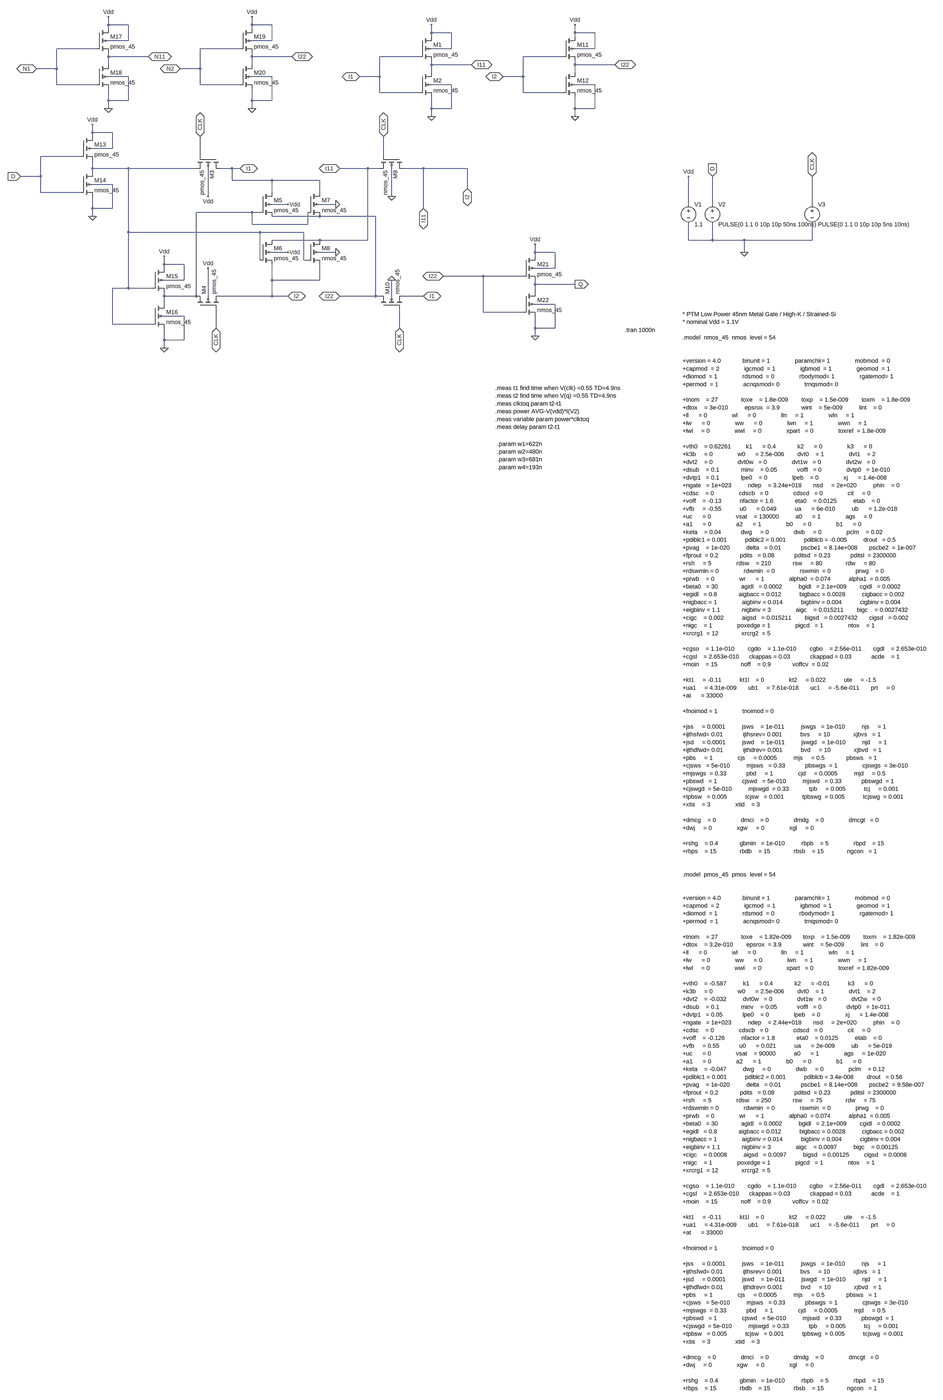
[diagram p0: schematic ACFF.asc, whole sheet]
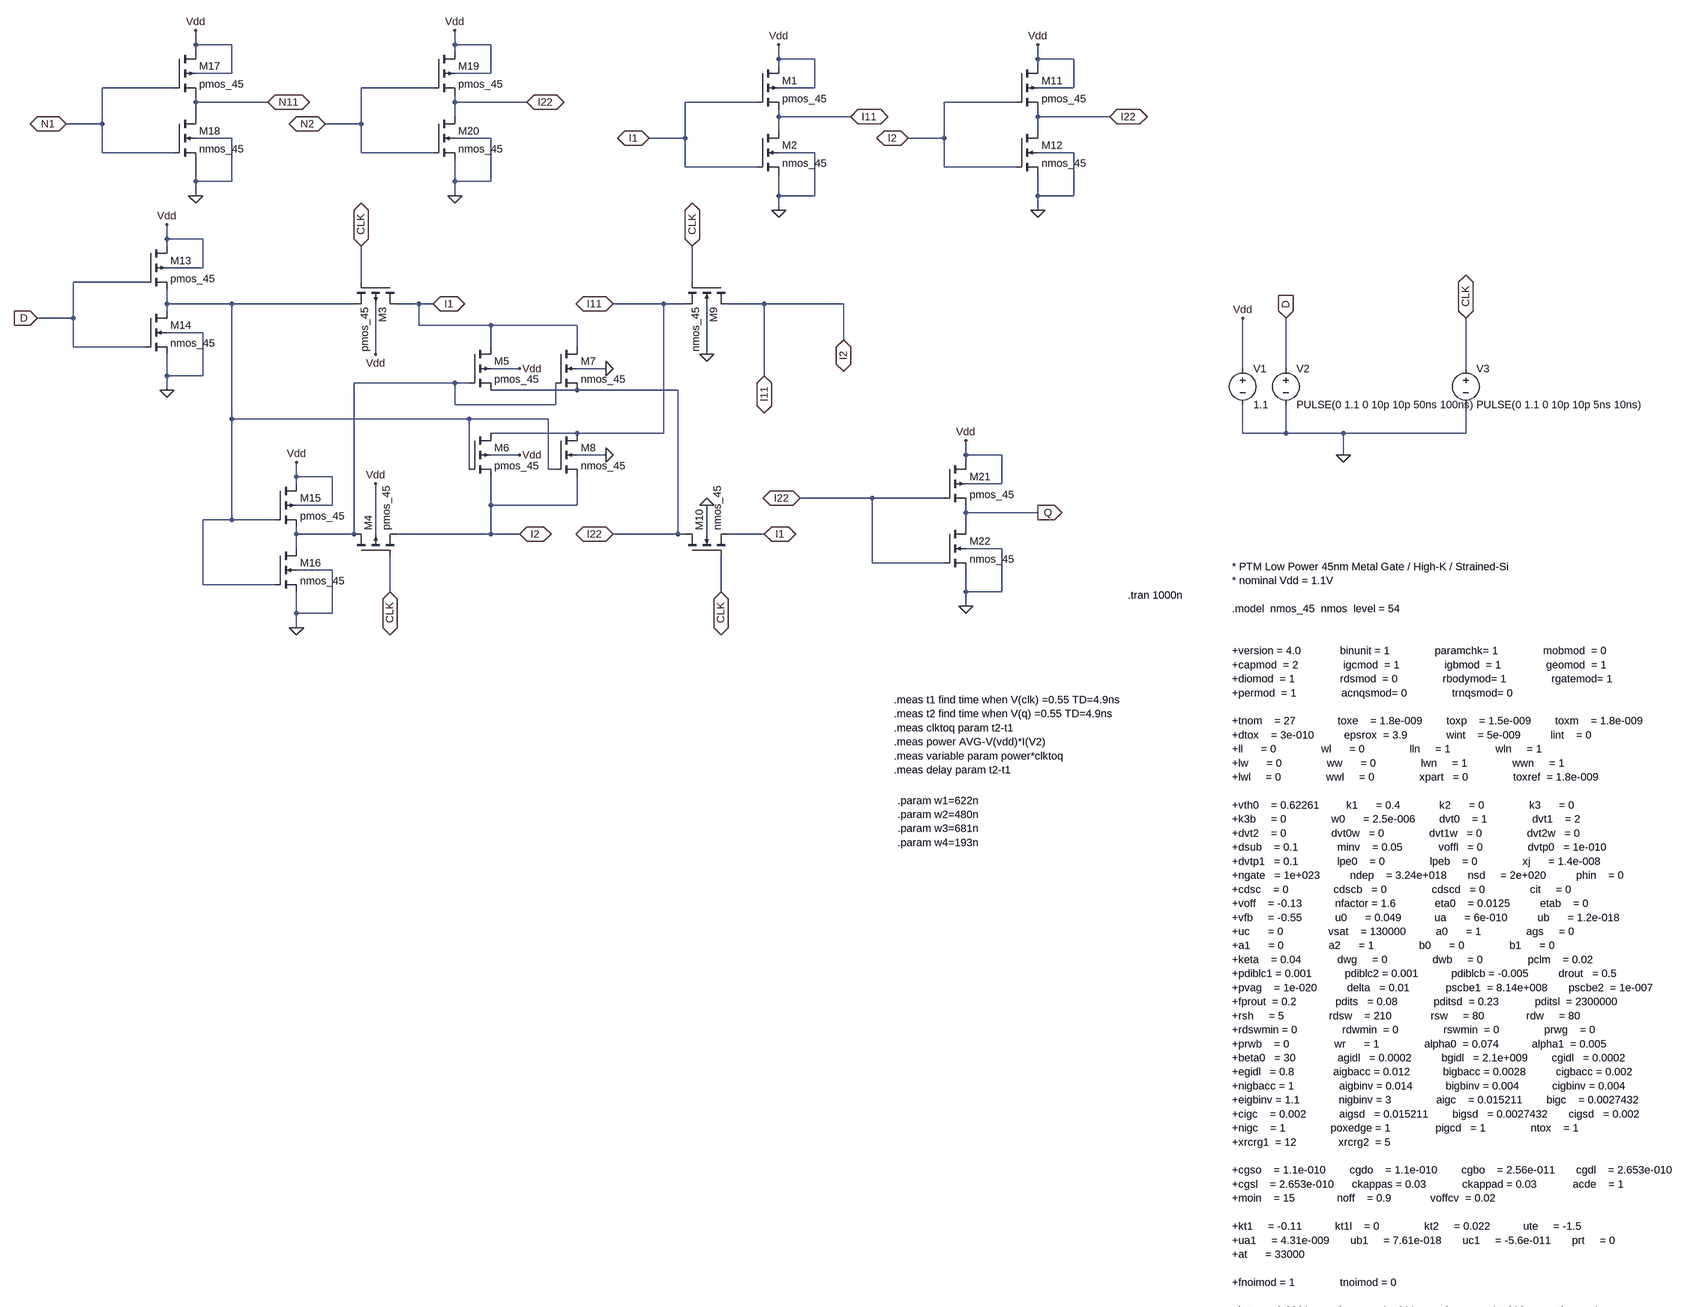
[diagram p1: schematic ACFF.asc, part, row 1 of 2, column 1 of 1]
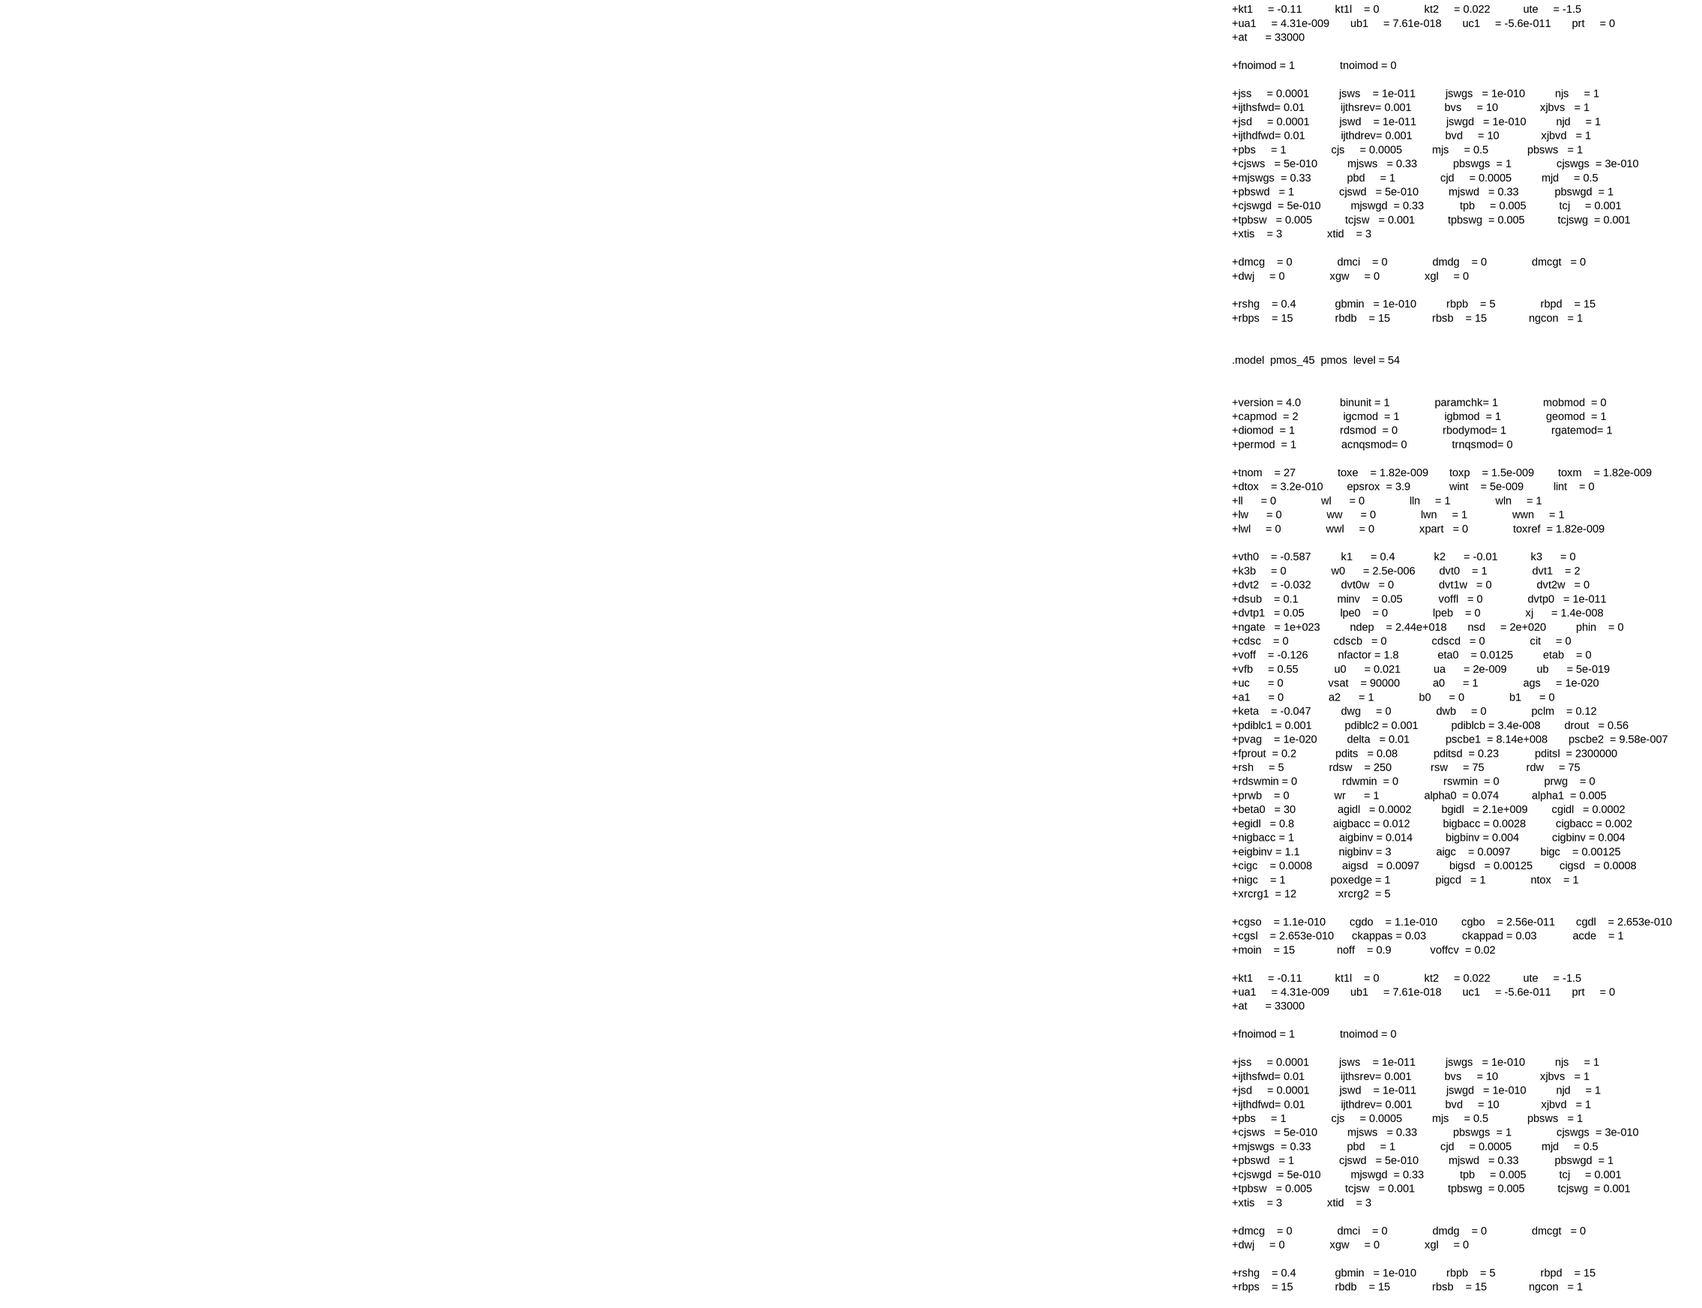
[diagram p2: schematic ACFF.asc, part, row 2 of 2, column 1 of 1]
ACFF.asc, the LTspice schematic file:
Version 4
SHEET 1 3184 4884
WIRE -432 -176 -432 -208
WIRE -352 -176 -432 -176
WIRE 144 -176 144 -208
WIRE 224 -176 144 -176
WIRE -432 -160 -432 -176
WIRE 144 -160 144 -176
WIRE 864 -144 864 -176
WIRE 944 -144 864 -144
WIRE 1440 -144 1440 -176
WIRE 1520 -144 1440 -144
WIRE 864 -128 864 -144
WIRE 1440 -128 1440 -144
WIRE -352 -112 -352 -176
WIRE -352 -112 -432 -112
WIRE 224 -112 224 -176
WIRE 224 -112 144 -112
WIRE -480 -80 -640 -80
WIRE 96 -80 -64 -80
WIRE 944 -80 944 -144
WIRE 944 -80 864 -80
WIRE 1520 -80 1520 -144
WIRE 1520 -80 1440 -80
WIRE -432 -48 -432 -64
WIRE -272 -48 -432 -48
WIRE 144 -48 144 -64
WIRE 304 -48 144 -48
WIRE 816 -48 656 -48
WIRE 1392 -48 1232 -48
WIRE -432 -16 -432 -48
WIRE 144 -16 144 -48
WIRE 864 -16 864 -32
WIRE 1024 -16 864 -16
WIRE 1440 -16 1440 -32
WIRE 1600 -16 1440 -16
WIRE -640 0 -640 -80
WIRE -640 0 -720 0
WIRE -64 0 -64 -80
WIRE -64 0 -144 0
WIRE 864 16 864 -16
WIRE 1440 16 1440 -16
WIRE -352 32 -432 32
WIRE 224 32 144 32
WIRE 656 32 656 -48
WIRE 656 32 576 32
WIRE 1232 32 1232 -48
WIRE 1232 32 1152 32
WIRE -640 64 -640 0
WIRE -480 64 -640 64
WIRE -64 64 -64 0
WIRE 96 64 -64 64
WIRE 944 64 864 64
WIRE 1520 64 1440 64
WIRE 656 96 656 32
WIRE 816 96 656 96
WIRE 1232 96 1232 32
WIRE 1392 96 1232 96
WIRE -432 128 -432 80
WIRE -352 128 -352 32
WIRE -352 128 -432 128
WIRE 144 128 144 80
WIRE 224 128 224 32
WIRE 224 128 144 128
WIRE -432 160 -432 128
WIRE 144 160 144 128
WIRE 864 160 864 112
WIRE 944 160 944 64
WIRE 944 160 864 160
WIRE 1440 160 1440 112
WIRE 1520 160 1520 64
WIRE 1520 160 1440 160
WIRE 864 192 864 160
WIRE 1440 192 1440 160
WIRE -496 256 -496 224
WIRE -416 256 -496 256
WIRE -496 272 -496 256
WIRE -416 320 -416 256
WIRE -416 320 -496 320
WIRE -544 352 -704 352
WIRE -64 352 -64 272
WIRE 672 352 672 272
WIRE -496 400 -496 368
WIRE -352 400 -496 400
WIRE -80 400 -352 400
WIRE 64 400 16 400
WIRE 96 400 64 400
WIRE 608 400 496 400
WIRE 656 400 608 400
WIRE 832 400 752 400
WIRE 1008 400 832 400
WIRE -496 416 -496 400
WIRE -704 432 -704 352
WIRE -704 432 -784 432
WIRE 64 448 64 400
WIRE 224 448 64 448
WIRE 416 448 224 448
WIRE -416 464 -496 464
WIRE 1008 480 1008 400
WIRE -704 496 -704 432
WIRE -544 496 -704 496
WIRE 224 496 224 448
WIRE 416 496 416 448
WIRE -32 512 -32 400
WIRE 704 512 704 400
WIRE 288 544 224 544
WIRE 480 544 416 544
WIRE 2112 544 2112 432
WIRE 2208 544 2208 432
WIRE 2608 544 2608 432
WIRE -496 560 -496 512
WIRE -416 560 -416 464
WIRE -416 560 -496 560
WIRE 832 560 832 400
WIRE 144 576 -80 576
WIRE 176 576 144 576
WIRE -496 592 -496 560
WIRE 416 592 224 592
WIRE 640 592 416 592
WIRE 144 624 144 576
WIRE 368 624 368 576
WIRE 368 624 144 624
WIRE -352 656 -352 400
WIRE 176 656 -352 656
WIRE 352 656 176 656
WIRE 416 688 224 688
WIRE 608 688 608 400
WIRE 608 688 416 688
WIRE 2112 688 2112 624
WIRE 2208 688 2208 624
WIRE 2208 688 2112 688
WIRE 2336 688 2208 688
WIRE 2608 688 2608 624
WIRE 2608 688 2336 688
WIRE 288 736 224 736
WIRE 480 736 416 736
WIRE 1280 736 1280 704
WIRE 1360 736 1280 736
WIRE 2336 736 2336 688
WIRE 1280 752 1280 736
WIRE 176 768 176 656
WIRE 352 768 352 656
WIRE 368 768 352 768
WIRE -208 784 -208 752
WIRE -128 784 -208 784
WIRE -208 800 -208 784
WIRE 1360 800 1360 736
WIRE 1360 800 1280 800
WIRE 1072 832 912 832
WIRE 1232 832 1072 832
WIRE -128 848 -128 784
WIRE -128 848 -208 848
WIRE 224 848 224 784
WIRE 416 848 416 784
WIRE 416 848 224 848
WIRE 1280 864 1280 848
WIRE 1440 864 1280 864
WIRE -352 880 -352 656
WIRE -352 880 -416 880
WIRE -256 880 -352 880
WIRE 1280 896 1280 864
WIRE -208 912 -208 896
WIRE -80 912 -80 576
WIRE -80 912 -208 912
WIRE -32 912 -32 800
WIRE 224 912 224 848
WIRE 224 912 16 912
WIRE 288 912 224 912
WIRE 640 912 640 592
WIRE 640 912 496 912
WIRE 656 912 640 912
WIRE 704 912 704 848
WIRE 832 912 752 912
WIRE -208 944 -208 912
WIRE 1360 944 1280 944
WIRE 1072 976 1072 832
WIRE 1232 976 1072 976
WIRE -128 992 -208 992
WIRE -416 1024 -416 880
WIRE -256 1024 -416 1024
WIRE 0 1040 0 960
WIRE 736 1040 736 960
WIRE 1280 1040 1280 992
WIRE 1360 1040 1360 944
WIRE 1360 1040 1280 1040
WIRE 1280 1072 1280 1040
WIRE -208 1088 -208 1040
WIRE -128 1088 -128 992
WIRE -128 1088 -208 1088
WIRE -208 1120 -208 1088
FLAG 864 -176 Vdd
FLAG 864 192 0
FLAG 576 32 I1
IOPIN 576 32 BiDir
FLAG 1024 -16 I11
IOPIN 1024 -16 BiDir
FLAG 1440 -176 Vdd
FLAG 1440 192 0
FLAG 1152 32 I2
IOPIN 1152 32 BiDir
FLAG 1600 -16 I22
IOPIN 1600 -16 BiDir
FLAG -496 224 Vdd
FLAG -496 592 0
FLAG -784 432 D
IOPIN -784 432 In
FLAG -208 752 Vdd
FLAG -208 1120 0
FLAG -64 272 CLK
IOPIN -64 272 BiDir
FLAG 672 272 CLK
IOPIN 672 272 BiDir
FLAG 0 1040 CLK
IOPIN 0 1040 BiDir
FLAG 736 1040 CLK
IOPIN 736 1040 BiDir
FLAG 96 400 I1
IOPIN 96 400 BiDir
FLAG 496 400 I11
IOPIN 496 400 BiDir
FLAG 288 912 I2
IOPIN 288 912 BiDir
FLAG 496 912 I22
IOPIN 496 912 BiDir
FLAG -432 -208 Vdd
FLAG -432 160 0
FLAG -720 0 N1
IOPIN -720 0 BiDir
FLAG -272 -48 N11
IOPIN -272 -48 BiDir
FLAG 144 -208 Vdd
FLAG 144 160 0
FLAG -144 0 N2
IOPIN -144 0 BiDir
FLAG 304 -48 I22
IOPIN 304 -48 BiDir
FLAG 1280 704 Vdd
FLAG 1280 1072 0
FLAG 832 912 I1
IOPIN 832 912 BiDir
FLAG 832 560 I11
IOPIN 832 560 BiDir
FLAG 1008 480 I2
IOPIN 1008 480 BiDir
FLAG 912 832 I22
IOPIN 912 832 BiDir
FLAG 1440 864 Q
IOPIN 1440 864 Out
FLAG 2208 432 D
IOPIN 2208 432 In
FLAG 2608 432 CLK
IOPIN 2608 432 BiDir
FLAG 2112 432 Vdd
FLAG 2336 736 0
FLAG -32 512 Vdd
FLAG -32 800 Vdd
FLAG 704 512 0
FLAG 288 544 Vdd
FLAG 288 736 Vdd
FLAG 480 736 0
FLAG 480 544 0
FLAG 704 848 0
SYMBOL pmos4 816 -128 R0
SYMATTR InstName M1
SYMATTR Value pmos_45
SYMATTR Value2 l=45n w=180n
SYMBOL nmos4 816 16 R0
SYMATTR InstName M2
SYMATTR Value nmos_45
SYMATTR Value2 l=45n w=90n
SYMBOL pmos4 16 352 R90
SYMATTR InstName M3
SYMATTR Value pmos_45
SYMATTR Value2 l=45n w=180n
SYMBOL pmos4 -80 960 R270
SYMATTR InstName M4
SYMATTR Value pmos_45
SYMATTR Value2 l=45n w=180n
SYMBOL pmos4 176 496 R0
SYMATTR InstName M5
SYMATTR Value pmos_45
SYMATTR Value2 l=45n w=180n
SYMBOL pmos4 176 688 R0
SYMATTR InstName M6
SYMATTR Value pmos_45
SYMATTR Value2 l=45n w=180n
SYMBOL nmos4 368 496 R0
SYMATTR InstName M7
SYMATTR Value nmos_45
SYMATTR Value2 l=45n w={w1}
SYMBOL nmos4 368 688 R0
SYMATTR InstName M8
SYMATTR Value nmos_45
SYMATTR Value2 l=45n w={w2}
SYMBOL nmos4 752 352 R90
SYMATTR InstName M9
SYMATTR Value nmos_45
SYMATTR Value2 l=45n w={w3}
SYMBOL nmos4 656 960 R270
SYMATTR InstName M10
SYMATTR Value nmos_45
SYMATTR Value2 l=45n w={w4}
SYMBOL pmos4 1392 -128 R0
SYMATTR InstName M11
SYMATTR Value pmos_45
SYMATTR Value2 l=45n w=180n
SYMBOL nmos4 1392 16 R0
SYMATTR InstName M12
SYMATTR Value nmos_45
SYMATTR Value2 l=45n w=90n
SYMBOL pmos4 -544 272 R0
SYMATTR InstName M13
SYMATTR Value pmos_45
SYMATTR Value2 l=45n w=180n
SYMBOL nmos4 -544 416 R0
SYMATTR InstName M14
SYMATTR Value nmos_45
SYMATTR Value2 l=45n w=90n
SYMBOL pmos4 -256 800 R0
SYMATTR InstName M15
SYMATTR Value pmos_45
SYMATTR Value2 l=45n w=180n
SYMBOL nmos4 -256 944 R0
SYMATTR InstName M16
SYMATTR Value nmos_45
SYMATTR Value2 l=45n w=90n
SYMBOL pmos4 -480 -160 R0
SYMATTR InstName M17
SYMATTR Value pmos_45
SYMATTR Value2 l=45n w=180n
SYMBOL nmos4 -480 -16 R0
SYMATTR InstName M18
SYMATTR Value nmos_45
SYMATTR Value2 l=45n w=90n
SYMBOL pmos4 96 -160 R0
SYMATTR InstName M19
SYMATTR Value pmos_45
SYMATTR Value2 l=45n w=180n
SYMBOL nmos4 96 -16 R0
SYMATTR InstName M20
SYMATTR Value nmos_45
SYMATTR Value2 l=45n w=90n
SYMBOL pmos4 1232 752 R0
SYMATTR InstName M21
SYMATTR Value pmos_45
SYMATTR Value2 l=45n w=180n
SYMBOL nmos4 1232 896 R0
SYMATTR InstName M22
SYMATTR Value nmos_45
SYMATTR Value2 l=45n w=90n
SYMBOL voltage 2112 528 R0
WINDOW 123 0 0 Left 0
WINDOW 39 0 0 Left 0
SYMATTR InstName V1
SYMATTR Value 1.1
SYMBOL voltage 2208 528 R0
WINDOW 123 0 0 Left 0
WINDOW 39 0 0 Left 0
SYMATTR InstName V2
SYMATTR Value PULSE(0 1.1 0 10p 10p 50ns 100ns)
SYMBOL voltage 2608 528 R0
WINDOW 123 0 0 Left 0
WINDOW 39 0 0 Left 0
SYMATTR InstName V3
SYMATTR Value PULSE(0 1.1 0 10p 10p 5ns 10ns)
TEXT 2088 984 Left 2 !* PTM Low Power 45nm Metal Gate / High-K / Strained-Si\n* nominal Vdd = 1.1V\n \n.model  nmos_45  nmos  level = 54\n \n \n+version = 4.0             binunit = 1               paramchk= 1               mobmod  = 0             \n+capmod  = 2               igcmod  = 1               igbmod  = 1               geomod  = 1             \n+diomod  = 1               rdsmod  = 0               rbodymod= 1               rgatemod= 1             \n+permod  = 1               acnqsmod= 0               trnqsmod= 0             \n \n+tnom    = 27              toxe    = 1.8e-009        toxp    = 1.5e-009        toxm    = 1.8e-009      \n+dtox    = 3e-010          epsrox  = 3.9             wint    = 5e-009          lint    = 0             \n+ll      = 0               wl      = 0               lln     = 1               wln     = 1             \n+lw      = 0               ww      = 0               lwn     = 1               wwn     = 1             \n+lwl     = 0               wwl     = 0               xpart   = 0               toxref  = 1.8e-009      \n \n+vth0    = 0.62261         k1      = 0.4             k2      = 0               k3      = 0             \n+k3b     = 0               w0      = 2.5e-006        dvt0    = 1               dvt1    = 2             \n+dvt2    = 0               dvt0w   = 0               dvt1w   = 0               dvt2w   = 0             \n+dsub    = 0.1             minv    = 0.05            voffl   = 0               dvtp0   = 1e-010        \n+dvtp1   = 0.1             lpe0    = 0               lpeb    = 0               xj      = 1.4e-008      \n+ngate   = 1e+023          ndep    = 3.24e+018       nsd     = 2e+020          phin    = 0             \n+cdsc    = 0               cdscb   = 0               cdscd   = 0               cit     = 0             \n+voff    = -0.13           nfactor = 1.6             eta0    = 0.0125          etab    = 0             \n+vfb     = -0.55           u0      = 0.049           ua      = 6e-010          ub      = 1.2e-018      \n+uc      = 0               vsat    = 130000          a0      = 1               ags     = 0             \n+a1      = 0               a2      = 1               b0      = 0               b1      = 0             \n+keta    = 0.04            dwg     = 0               dwb     = 0               pclm    = 0.02          \n+pdiblc1 = 0.001           pdiblc2 = 0.001           pdiblcb = -0.005          drout   = 0.5           \n+pvag    = 1e-020          delta   = 0.01            pscbe1  = 8.14e+008       pscbe2  = 1e-007        \n+fprout  = 0.2             pdits   = 0.08            pditsd  = 0.23            pditsl  = 2300000       \n+rsh     = 5               rdsw    = 210             rsw     = 80              rdw     = 80            \n+rdswmin = 0               rdwmin  = 0               rswmin  = 0               prwg    = 0             \n+prwb    = 0               wr      = 1               alpha0  = 0.074           alpha1  = 0.005         \n+beta0   = 30              agidl   = 0.0002          bgidl   = 2.1e+009        cgidl   = 0.0002        \n+egidl   = 0.8             aigbacc = 0.012           bigbacc = 0.0028          cigbacc = 0.002         \n+nigbacc = 1               aigbinv = 0.014           bigbinv = 0.004           cigbinv = 0.004         \n+eigbinv = 1.1             nigbinv = 3               aigc    = 0.015211        bigc    = 0.0027432     \n+cigc    = 0.002           aigsd   = 0.015211        bigsd   = 0.0027432       cigsd   = 0.002         \n+nigc    = 1               poxedge = 1               pigcd   = 1               ntox    = 1             \n+xrcrg1  = 12              xrcrg2  = 5             \n \n+cgso    = 1.1e-010        cgdo    = 1.1e-010        cgbo    = 2.56e-011       cgdl    = 2.653e-010    \n+cgsl    = 2.653e-010      ckappas = 0.03            ckappad = 0.03            acde    = 1             \n+moin    = 15              noff    = 0.9             voffcv  = 0.02          \n \n+kt1     = -0.11           kt1l    = 0               kt2     = 0.022           ute     = -1.5          \n+ua1     = 4.31e-009       ub1     = 7.61e-018       uc1     = -5.6e-011       prt     = 0             \n+at      = 33000         \n \n+fnoimod = 1               tnoimod = 0             \n \n+jss     = 0.0001          jsws    = 1e-011          jswgs   = 1e-010          njs     = 1             \n+ijthsfwd= 0.01            ijthsrev= 0.001           bvs     = 10              xjbvs   = 1             \n+jsd     = 0.0001          jswd    = 1e-011          jswgd   = 1e-010          njd     = 1             \n+ijthdfwd= 0.01            ijthdrev= 0.001           bvd     = 10              xjbvd   = 1             \n+pbs     = 1               cjs     = 0.0005          mjs     = 0.5             pbsws   = 1             \n+cjsws   = 5e-010          mjsws   = 0.33            pbswgs  = 1               cjswgs  = 3e-010        \n+mjswgs  = 0.33            pbd     = 1               cjd     = 0.0005          mjd     = 0.5           \n+pbswd   = 1               cjswd   = 5e-010          mjswd   = 0.33            pbswgd  = 1             \n+cjswgd  = 5e-010          mjswgd  = 0.33            tpb     = 0.005           tcj     = 0.001         \n+tpbsw   = 0.005           tcjsw   = 0.001           tpbswg  = 0.005           tcjswg  = 0.001         \n+xtis    = 3               xtid    = 3             \n \n+dmcg    = 0               dmci    = 0               dmdg    = 0               dmcgt   = 0             \n+dwj     = 0               xgw     = 0               xgl     = 0             \n \n+rshg    = 0.4             gbmin   = 1e-010          rbpb    = 5               rbpd    = 15            \n+rbps    = 15              rbdb    = 15              rbsb    = 15              ngcon   = 1             \n \n \n.model  pmos_45  pmos  level = 54\n \n \n+version = 4.0             binunit = 1               paramchk= 1               mobmod  = 0             \n+capmod  = 2               igcmod  = 1               igbmod  = 1               geomod  = 1             \n+diomod  = 1               rdsmod  = 0               rbodymod= 1               rgatemod= 1             \n+permod  = 1               acnqsmod= 0               trnqsmod= 0             \n \n+tnom    = 27              toxe    = 1.82e-009       toxp    = 1.5e-009        toxm    = 1.82e-009     \n+dtox    = 3.2e-010        epsrox  = 3.9             wint    = 5e-009          lint    = 0             \n+ll      = 0               wl      = 0               lln     = 1               wln     = 1             \n+lw      = 0               ww      = 0               lwn     = 1               wwn     = 1             \n+lwl     = 0               wwl     = 0               xpart   = 0               toxref  = 1.82e-009     \n \n+vth0    = -0.587          k1      = 0.4             k2      = -0.01           k3      = 0             \n+k3b     = 0               w0      = 2.5e-006        dvt0    = 1               dvt1    = 2             \n+dvt2    = -0.032          dvt0w   = 0               dvt1w   = 0               dvt2w   = 0             \n+dsub    = 0.1             minv    = 0.05            voffl   = 0               dvtp0   = 1e-011        \n+dvtp1   = 0.05            lpe0    = 0               lpeb    = 0               xj      = 1.4e-008      \n+ngate   = 1e+023          ndep    = 2.44e+018       nsd     = 2e+020          phin    = 0             \n+cdsc    = 0               cdscb   = 0               cdscd   = 0               cit     = 0             \n+voff    = -0.126          nfactor = 1.8             eta0    = 0.0125          etab    = 0             \n+vfb     = 0.55            u0      = 0.021           ua      = 2e-009          ub      = 5e-019        \n+uc      = 0               vsat    = 90000           a0      = 1               ags     = 1e-020        \n+a1      = 0               a2      = 1               b0      = 0               b1      = 0             \n+keta    = -0.047          dwg     = 0               dwb     = 0               pclm    = 0.12          \n+pdiblc1 = 0.001           pdiblc2 = 0.001           pdiblcb = 3.4e-008        drout   = 0.56          \n+pvag    = 1e-020          delta   = 0.01            pscbe1  = 8.14e+008       pscbe2  = 9.58e-007     \n+fprout  = 0.2             pdits   = 0.08            pditsd  = 0.23            pditsl  = 2300000       \n+rsh     = 5               rdsw    = 250             rsw     = 75              rdw     = 75            \n+rdswmin = 0               rdwmin  = 0               rswmin  = 0               prwg    = 0             \n+prwb    = 0               wr      = 1               alpha0  = 0.074           alpha1  = 0.005         \n+beta0   = 30              agidl   = 0.0002          bgidl   = 2.1e+009        cgidl   = 0.0002        \n+egidl   = 0.8             aigbacc = 0.012           bigbacc = 0.0028          cigbacc = 0.002         \n+nigbacc = 1               aigbinv = 0.014           bigbinv = 0.004           cigbinv = 0.004         \n+eigbinv = 1.1             nigbinv = 3               aigc    = 0.0097          bigc    = 0.00125       \n+cigc    = 0.0008          aigsd   = 0.0097          bigsd   = 0.00125         cigsd   = 0.0008        \n+nigc    = 1               poxedge = 1               pigcd   = 1               ntox    = 1             \n+xrcrg1  = 12              xrcrg2  = 5             \n \n+cgso    = 1.1e-010        cgdo    = 1.1e-010        cgbo    = 2.56e-011       cgdl    = 2.653e-010    \n+cgsl    = 2.653e-010      ckappas = 0.03            ckappad = 0.03            acde    = 1             \n+moin    = 15              noff    = 0.9             voffcv  = 0.02          \n \n+kt1     = -0.11           kt1l    = 0               kt2     = 0.022           ute     = -1.5          \n+ua1     = 4.31e-009       ub1     = 7.61e-018       uc1     = -5.6e-011       prt     = 0             \n+at      = 33000         \n \n+fnoimod = 1               tnoimod = 0             \n \n+jss     = 0.0001          jsws    = 1e-011          jswgs   = 1e-010          njs     = 1             \n+ijthsfwd= 0.01            ijthsrev= 0.001           bvs     = 10              xjbvs   = 1             \n+jsd     = 0.0001          jswd    = 1e-011          jswgd   = 1e-010          njd     = 1             \n+ijthdfwd= 0.01            ijthdrev= 0.001           bvd     = 10              xjbvd   = 1             \n+pbs     = 1               cjs     = 0.0005          mjs     = 0.5             pbsws   = 1             \n+cjsws   = 5e-010          mjsws   = 0.33            pbswgs  = 1               cjswgs  = 3e-010        \n+mjswgs  = 0.33            pbd     = 1               cjd     = 0.0005          mjd     = 0.5           \n+pbswd   = 1               cjswd   = 5e-010          mjswd   = 0.33            pbswgd  = 1             \n+cjswgd  = 5e-010          mjswgd  = 0.33            tpb     = 0.005           tcj     = 0.001         \n+tpbsw   = 0.005           tcjsw   = 0.001           tpbswg  = 0.005           tcjswg  = 0.001         \n+xtis    = 3               xtid    = 3             \n \n+dmcg    = 0               dmci    = 0               dmdg    = 0               dmcgt   = 0             \n+dwj     = 0               xgw     = 0               xgl     = 0             \n \n+rshg    = 0.4             gbmin   = 1e-010          rbpb    = 5               rbpd    = 15            \n+rbps    = 15              rbdb    = 15              rbsb    = 15              ngcon   = 1
TEXT 1640 1048 Left 2 !.tran 1000n
TEXT 1120 1280 Left 2 !.meas t1 find time when V(clk) =0.55 TD=4.9ns\n.meas t2 find time when V(q) =0.55 TD=4.9ns\n.meas clktoq param t2-t1\n.meas power AVG-V(vdd)*I(V2)\n.meas variable param power*clktoq\n.meas delay param t2-t1
TEXT 1128 1504 Left 2 !.param w1=622n \n.param w2=480n\n.param w3=681n\n.param w4=193n

The netlist it stands for:
* ACFF.asc
M1 Vdd I1 I2 Vdd pmos_45 l=45n w=180n
M2 I2 I1 0 0 nmos_45 l=45n w=90n
M3 I1 CLK N001 Vdd pmos_45 l=45n w=180n
M4 N002 CLK I2 Vdd pmos_45 l=45n w=180n
M5 I1 N002 I22 Vdd pmos_45 l=45n w=180n
M6 I2 N001 I2 Vdd pmos_45 l=45n w=180n
M7 I1 N002 I22 0 nmos_45 l=45n w={w1}
M8 I2 N001 I2 0 nmos_45 l=45n w={w2}
M9 I2 CLK I2 0 nmos_45 l=45n w={w3}
M10 I22 CLK I1 0 nmos_45 l=45n w={w4}
M11 Vdd I2 I22 Vdd pmos_45 l=45n w=180n
M12 I22 I2 0 0 nmos_45 l=45n w=90n
M13 Vdd D N001 Vdd pmos_45 l=45n w=180n
M14 N001 D 0 0 nmos_45 l=45n w=90n
M15 Vdd N001 N002 Vdd pmos_45 l=45n w=180n
M16 N002 N001 0 0 nmos_45 l=45n w=90n
M17 Vdd N1 N11 Vdd pmos_45 l=45n w=180n
M18 N11 N1 0 0 nmos_45 l=45n w=90n
M19 Vdd N2 I22 Vdd pmos_45 l=45n w=180n
M20 I22 N2 0 0 nmos_45 l=45n w=90n
M21 Vdd I22 Q Vdd pmos_45 l=45n w=180n
M22 Q I22 0 0 nmos_45 l=45n w=90n
V1 Vdd 0 1.1
V2 D 0 PULSE(0 1.1 0 10p 10p 50ns 100ns)
V3 CLK 0 PULSE(0 1.1 0 10p 10p 5ns 10ns)
.model NMOS NMOS
.model PMOS PMOS
.lib standard.mos
* PTM Low Power 45nm Metal Gate / High-K / Strained-Si
* nominal Vdd = 1.1V
.model  nmos_45  nmos  level = 54
+version = 4.0             binunit = 1               paramchk= 1               mobmod  = 0
+capmod  = 2               igcmod  = 1               igbmod  = 1               geomod  = 1
+diomod  = 1               rdsmod  = 0               rbodymod= 1               rgatemod= 1
+permod  = 1               acnqsmod= 0               trnqsmod= 0
+tnom    = 27              toxe    = 1.8e-009        toxp    = 1.5e-009        toxm    = 1.8e-009
+dtox    = 3e-010          epsrox  = 3.9             wint    = 5e-009          lint    = 0
+ll      = 0               wl      = 0               lln     = 1               wln     = 1
+lw      = 0               ww      = 0               lwn     = 1               wwn     = 1
+lwl     = 0               wwl     = 0               xpart   = 0               toxref  = 1.8e-009
+vth0    = 0.62261         k1      = 0.4             k2      = 0               k3      = 0
+k3b     = 0               w0      = 2.5e-006        dvt0    = 1               dvt1    = 2
+dvt2    = 0               dvt0w   = 0               dvt1w   = 0               dvt2w   = 0
+dsub    = 0.1             minv    = 0.05            voffl   = 0               dvtp0   = 1e-010
+dvtp1   = 0.1             lpe0    = 0               lpeb    = 0               xj      = 1.4e-008
+ngate   = 1e+023          ndep    = 3.24e+018       nsd     = 2e+020          phin    = 0
+cdsc    = 0               cdscb   = 0               cdscd   = 0               cit     = 0
+voff    = -0.13           nfactor = 1.6             eta0    = 0.0125          etab    = 0
+vfb     = -0.55           u0      = 0.049           ua      = 6e-010          ub      = 1.2e-018
+uc      = 0               vsat    = 130000          a0      = 1               ags     = 0
+a1      = 0               a2      = 1               b0      = 0               b1      = 0
+keta    = 0.04            dwg     = 0               dwb     = 0               pclm    = 0.02
+pdiblc1 = 0.001           pdiblc2 = 0.001           pdiblcb = -0.005          drout   = 0.5
+pvag    = 1e-020          delta   = 0.01            pscbe1  = 8.14e+008       pscbe2  = 1e-007
+fprout  = 0.2             pdits   = 0.08            pditsd  = 0.23            pditsl  = 2300000
+rsh     = 5               rdsw    = 210             rsw     = 80              rdw     = 80
+rdswmin = 0               rdwmin  = 0               rswmin  = 0               prwg    = 0
+prwb    = 0               wr      = 1               alpha0  = 0.074           alpha1  = 0.005
+beta0   = 30              agidl   = 0.0002          bgidl   = 2.1e+009        cgidl   = 0.0002
+egidl   = 0.8             aigbacc = 0.012           bigbacc = 0.0028          cigbacc = 0.002
+nigbacc = 1               aigbinv = 0.014           bigbinv = 0.004           cigbinv = 0.004
+eigbinv = 1.1             nigbinv = 3               aigc    = 0.015211        bigc    = 0.0027432
+cigc    = 0.002           aigsd   = 0.015211        bigsd   = 0.0027432       cigsd   = 0.002
+nigc    = 1               poxedge = 1               pigcd   = 1               ntox    = 1
+xrcrg1  = 12              xrcrg2  = 5
+cgso    = 1.1e-010        cgdo    = 1.1e-010        cgbo    = 2.56e-011       cgdl    = 2.653e-010
+cgsl    = 2.653e-010      ckappas = 0.03            ckappad = 0.03            acde    = 1
+moin    = 15              noff    = 0.9             voffcv  = 0.02
+kt1     = -0.11           kt1l    = 0               kt2     = 0.022           ute     = -1.5
+ua1     = 4.31e-009       ub1     = 7.61e-018       uc1     = -5.6e-011       prt     = 0
+at      = 33000
+fnoimod = 1               tnoimod = 0
+jss     = 0.0001          jsws    = 1e-011          jswgs   = 1e-010          njs     = 1
+ijthsfwd= 0.01            ijthsrev= 0.001           bvs     = 10              xjbvs   = 1
+jsd     = 0.0001          jswd    = 1e-011          jswgd   = 1e-010          njd     = 1
+ijthdfwd= 0.01            ijthdrev= 0.001           bvd     = 10              xjbvd   = 1
+pbs     = 1               cjs     = 0.0005          mjs     = 0.5             pbsws   = 1
+cjsws   = 5e-010          mjsws   = 0.33            pbswgs  = 1               cjswgs  = 3e-010
+mjswgs  = 0.33            pbd     = 1               cjd     = 0.0005          mjd     = 0.5
+pbswd   = 1               cjswd   = 5e-010          mjswd   = 0.33            pbswgd  = 1
+cjswgd  = 5e-010          mjswgd  = 0.33            tpb     = 0.005           tcj     = 0.001
+tpbsw   = 0.005           tcjsw   = 0.001           tpbswg  = 0.005           tcjswg  = 0.001
+xtis    = 3               xtid    = 3
+dmcg    = 0               dmci    = 0               dmdg    = 0               dmcgt   = 0
+dwj     = 0               xgw     = 0               xgl     = 0
+rshg    = 0.4             gbmin   = 1e-010          rbpb    = 5               rbpd    = 15
+rbps    = 15              rbdb    = 15              rbsb    = 15              ngcon   = 1
.model  pmos_45  pmos  level = 54
+version = 4.0             binunit = 1               paramchk= 1               mobmod  = 0
+capmod  = 2               igcmod  = 1               igbmod  = 1               geomod  = 1
+diomod  = 1               rdsmod  = 0               rbodymod= 1               rgatemod= 1
+permod  = 1               acnqsmod= 0               trnqsmod= 0
+tnom    = 27              toxe    = 1.82e-009       toxp    = 1.5e-009        toxm    = 1.82e-009
+dtox    = 3.2e-010        epsrox  = 3.9             wint    = 5e-009          lint    = 0
+ll      = 0               wl      = 0               lln     = 1               wln     = 1
+lw      = 0               ww      = 0               lwn     = 1               wwn     = 1
+lwl     = 0               wwl     = 0               xpart   = 0               toxref  = 1.82e-009
+vth0    = -0.587          k1      = 0.4             k2      = -0.01           k3      = 0
+k3b     = 0               w0      = 2.5e-006        dvt0    = 1               dvt1    = 2
+dvt2    = -0.032          dvt0w   = 0               dvt1w   = 0               dvt2w   = 0
+dsub    = 0.1             minv    = 0.05            voffl   = 0               dvtp0   = 1e-011
+dvtp1   = 0.05            lpe0    = 0               lpeb    = 0               xj      = 1.4e-008
+ngate   = 1e+023          ndep    = 2.44e+018       nsd     = 2e+020          phin    = 0
+cdsc    = 0               cdscb   = 0               cdscd   = 0               cit     = 0
+voff    = -0.126          nfactor = 1.8             eta0    = 0.0125          etab    = 0
+vfb     = 0.55            u0      = 0.021           ua      = 2e-009          ub      = 5e-019
+uc      = 0               vsat    = 90000           a0      = 1               ags     = 1e-020
+a1      = 0               a2      = 1               b0      = 0               b1      = 0
+keta    = -0.047          dwg     = 0               dwb     = 0               pclm    = 0.12
+pdiblc1 = 0.001           pdiblc2 = 0.001           pdiblcb = 3.4e-008        drout   = 0.56
+pvag    = 1e-020          delta   = 0.01            pscbe1  = 8.14e+008       pscbe2  = 9.58e-007
+fprout  = 0.2             pdits   = 0.08            pditsd  = 0.23            pditsl  = 2300000
+rsh     = 5               rdsw    = 250             rsw     = 75              rdw     = 75
+rdswmin = 0               rdwmin  = 0               rswmin  = 0               prwg    = 0
+prwb    = 0               wr      = 1               alpha0  = 0.074           alpha1  = 0.005
+beta0   = 30              agidl   = 0.0002          bgidl   = 2.1e+009        cgidl   = 0.0002
+egidl   = 0.8             aigbacc = 0.012           bigbacc = 0.0028          cigbacc = 0.002
+nigbacc = 1               aigbinv = 0.014           bigbinv = 0.004           cigbinv = 0.004
+eigbinv = 1.1             nigbinv = 3               aigc    = 0.0097          bigc    = 0.00125
+cigc    = 0.0008          aigsd   = 0.0097          bigsd   = 0.00125         cigsd   = 0.0008
+nigc    = 1               poxedge = 1               pigcd   = 1               ntox    = 1
+xrcrg1  = 12              xrcrg2  = 5
+cgso    = 1.1e-010        cgdo    = 1.1e-010        cgbo    = 2.56e-011       cgdl    = 2.653e-010
+cgsl    = 2.653e-010      ckappas = 0.03            ckappad = 0.03            acde    = 1
+moin    = 15              noff    = 0.9             voffcv  = 0.02
+kt1     = -0.11           kt1l    = 0               kt2     = 0.022           ute     = -1.5
+ua1     = 4.31e-009       ub1     = 7.61e-018       uc1     = -5.6e-011       prt     = 0
+at      = 33000
+fnoimod = 1               tnoimod = 0
+jss     = 0.0001          jsws    = 1e-011          jswgs   = 1e-010          njs     = 1
+ijthsfwd= 0.01            ijthsrev= 0.001           bvs     = 10              xjbvs   = 1
+jsd     = 0.0001          jswd    = 1e-011          jswgd   = 1e-010          njd     = 1
+ijthdfwd= 0.01            ijthdrev= 0.001           bvd     = 10              xjbvd   = 1
+pbs     = 1               cjs     = 0.0005          mjs     = 0.5             pbsws   = 1
+cjsws   = 5e-010          mjsws   = 0.33            pbswgs  = 1               cjswgs  = 3e-010
+mjswgs  = 0.33            pbd     = 1               cjd     = 0.0005          mjd     = 0.5
+pbswd   = 1               cjswd   = 5e-010          mjswd   = 0.33            pbswgd  = 1
+cjswgd  = 5e-010          mjswgd  = 0.33            tpb     = 0.005           tcj     = 0.001
+tpbsw   = 0.005           tcjsw   = 0.001           tpbswg  = 0.005           tcjswg  = 0.001
+xtis    = 3               xtid    = 3
+dmcg    = 0               dmci    = 0               dmdg    = 0               dmcgt   = 0
+dwj     = 0               xgw     = 0               xgl     = 0
+rshg    = 0.4             gbmin   = 1e-010          rbpb    = 5               rbpd    = 15
+rbps    = 15              rbdb    = 15              rbsb    = 15              ngcon   = 1
.tran 1000n
.meas t1 find time when V(clk) =0.55 TD=4.9ns
.meas t2 find time when V(q) =0.55 TD=4.9ns
.meas clktoq param t2-t1
.meas power AVG-V(vdd)*I(V2)
.meas variable param power*clktoq
.meas delay param t2-t1
.param w1=622n
.param w2=480n
.param w3=681n
.param w4=193n
.backanno
.end